# EAGLE schematic slave (EAGLE 9.5.0)
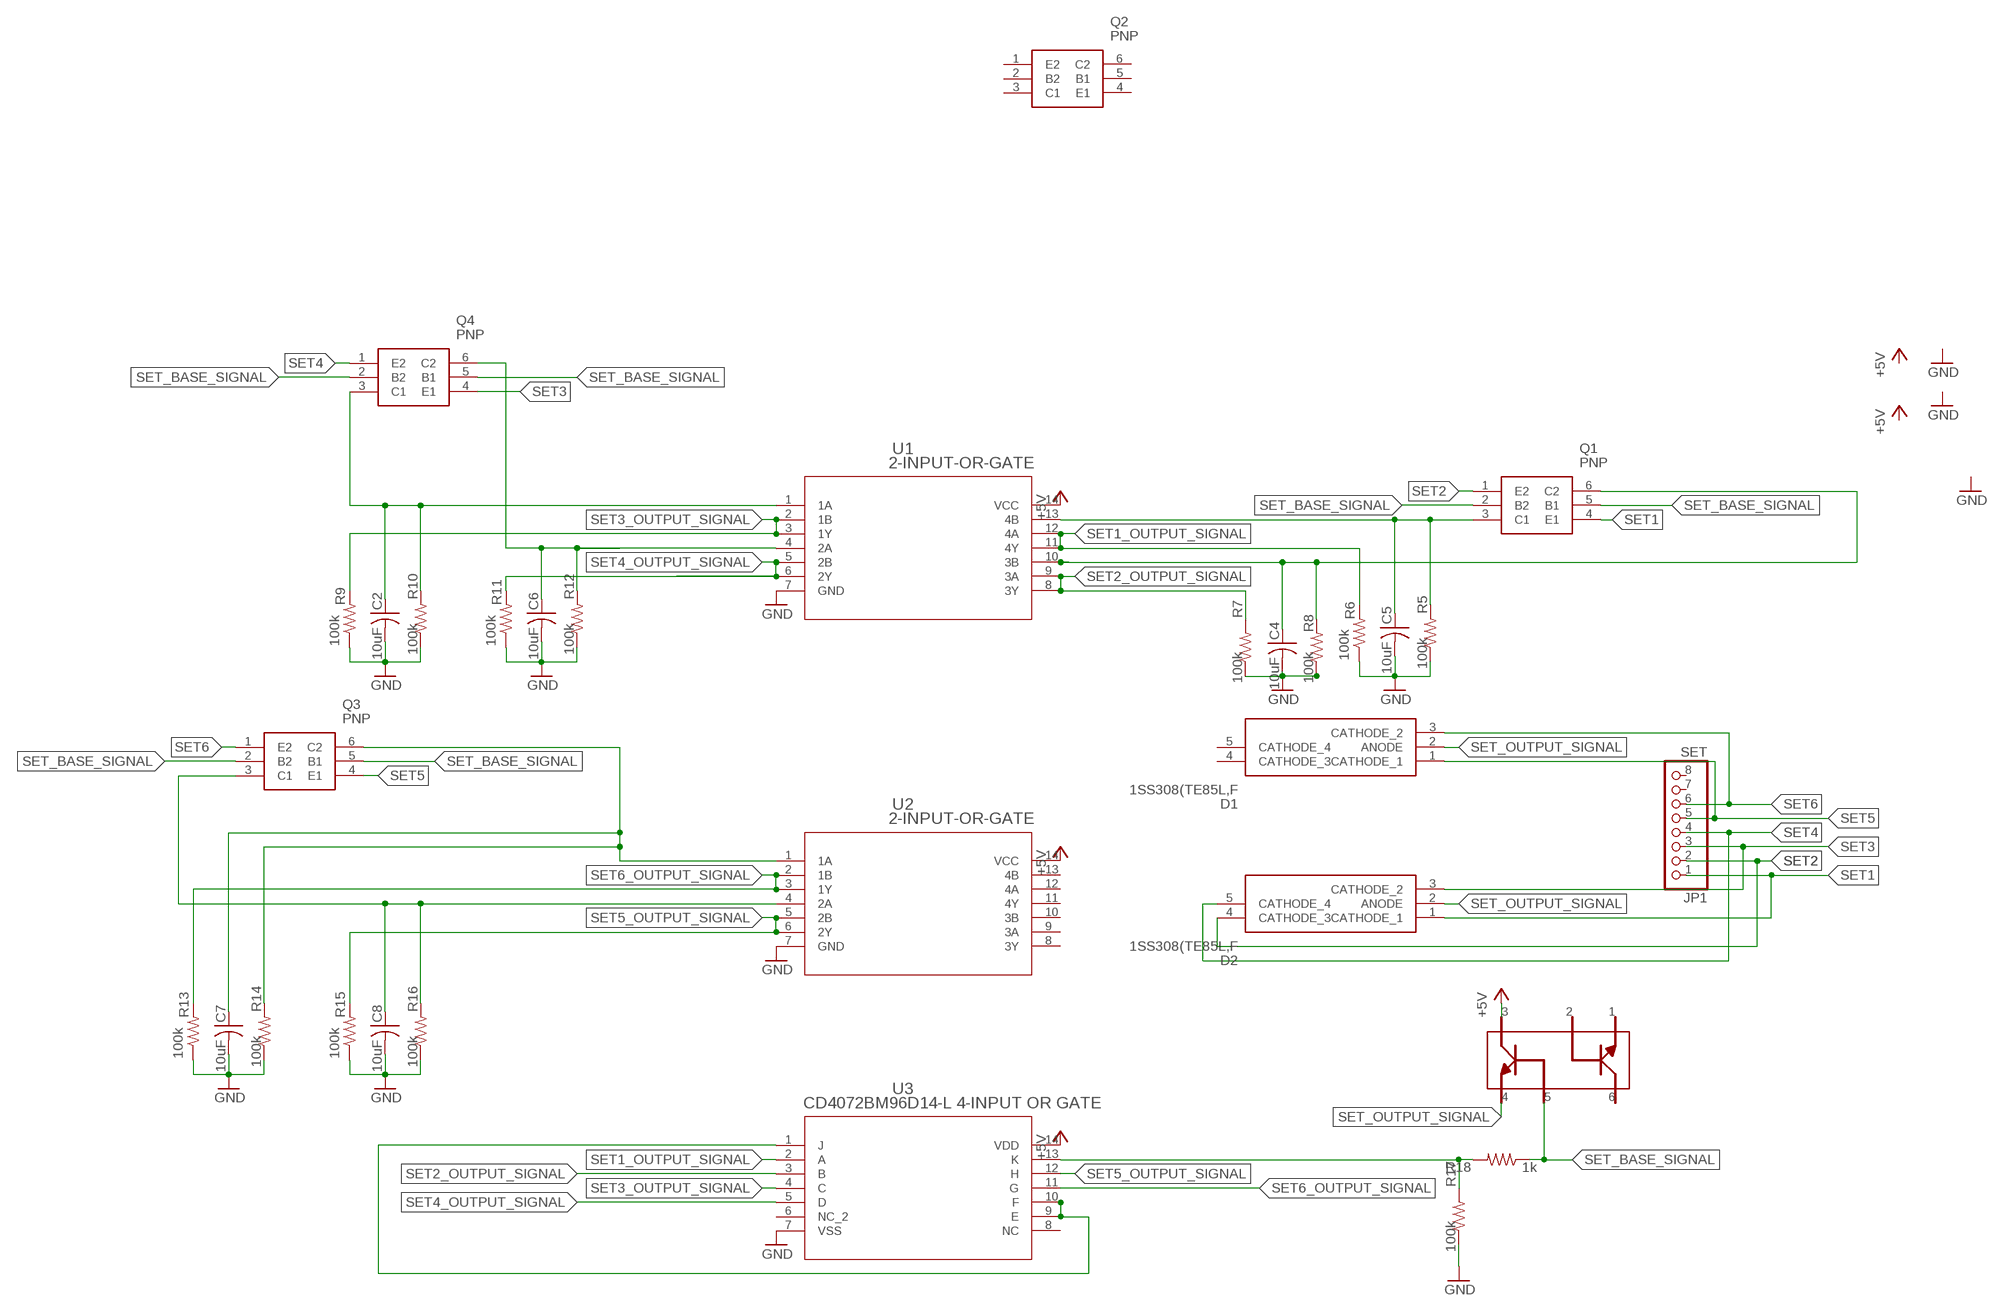
[diagram p0: schematic, sheet 1, part 1 of 2]
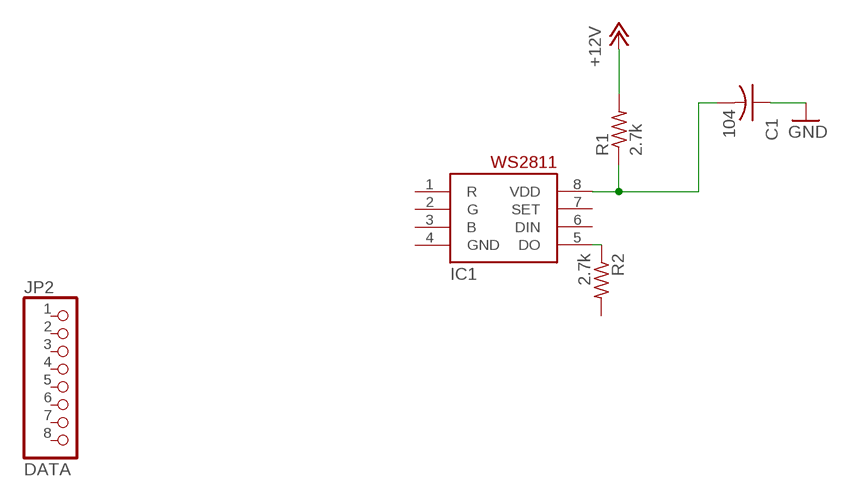
[diagram p1: schematic, sheet 1, part 2 of 2]

## Parts
C1  104  C-USC0805  [C0805]
C2  10uF  C-USC0805  [C0805]
C4  10uF  C-USC0805  [C0805]
C5  10uF  C-USC0805  [C0805]
C6  10uF  C-USC0805  [C0805]
C7  10uF  C-USC0805  [C0805]
C8  10uF  C-USC0805  [C0805]
D1  1SS308(TE85L,F  [SOT95P275X130-5N]
D2  1SS308(TE85L,F  [SOT95P275X130-5N]
IC1  WS2811-SOP8  [SO08-SKINNYPADS]
JP1  SET  PINHD-1X8-3.5MM  [1X08-3.5MM]
JP2  DATA  PINHD-1X8-3.5MM  [1X08-3.5MM]
Q1  PNP  MBT3906DW1T1G  [SOT65P210X110-6N]
Q2  PNP  MBT3906DW1T1G  [SOT65P210X110-6N]
Q3  PNP  MBT3906DW1T1G  [SOT65P210X110-6N]
Q4  PNP  MBT3906DW1T1G  [SOT65P210X110-6N]
R1  2.7k  R-US_M0805  [M0805]
R2  2.7k  R-US_M0805  [M0805]
R5  100k  R-US_M0805  [M0805]
R6  100k  R-US_M0805  [M0805]
R7  100k  R-US_M0805  [M0805]
R8  100k  R-US_M0805  [M0805]
R9  100k  R-US_M0805  [M0805]
R10  100k  R-US_M0805  [M0805]
R11  100k  R-US_M0805  [M0805]
R12  100k  R-US_M0805  [M0805]
R13  100k  R-US_M0805  [M0805]
R14  100k  R-US_M0805  [M0805]
R15  100k  R-US_M0805  [M0805]
R16  100k  R-US_M0805  [M0805]
R17  100k  R-US_M0805  [M0805]
R18  1k  R-US_M0805  [M0805]
U1  2-INPUT-OR-GATE  SN74AC32DRD14-L  [D14-L]
U2  2-INPUT-OR-GATE  SN74AC32DRD14-L  [D14-L]
U3  CD4072BM96D14-L 4-INPUT OR GATE  CD4072BM96D14-L  [D14-L]
U$1  MBT3904DW1T1G  [SOT236]

## Nets
+5V: U1.14(VCC) U2.14(VCC) U3.14(VDD) U$1.3
+12V: R1.2
GND: C1.1 C2.2 C4.2 C5.2 C6.2 C7.2 C8.2 R5.1 R6.1 R7.1 R8.1 R9.1 R10.1 R11.1 R12.1 R13.1 R14.1 R15.1 R16.1 R17.1 U1.7(GND) U2.7(GND) U3.7(VSS)
N$1: IC1.5(DO) R2.1
N$2: C1.2 IC1.8(VDD) R1.1
N$3: C6.1
N$4: C5.1 Q1.3(C1) R5.2 U1.13(4B)
N$10: U3.1(J) U3.9(E) U3.10(F)
N$12: Q4.6(C2) R12.2 U1.4(2A)
N$15: C4.1 Q1.6(C2) R8.2 U1.10(3B)
N$17: C2.1 Q4.3(C1) R10.2 U1.1(1A)
N$19: R17.2 R18.2 U3.13(K)
N$26: C7.1 Q3.6(C2) R14.2 U2.1(1A)
N$29: C8.1 Q3.3(C1) R16.2 U2.4(2A)
SET1: D2.1(CATHODE_1) JP1.1 Q1.4(E1)
SET1_OUTPUT_SIGNAL: R6.2 U1.11(4Y) U1.12(4A) U3.2(A)
SET2: D2.4(CATHODE_3) JP1.2 Q1.1(E2)
SET2_OUTPUT_SIGNAL: R7.2 U1.8(3Y) U1.9(3A) U3.3(B)
SET3: D2.3(CATHODE_2) JP1.3 Q4.4(E1)
SET3_OUTPUT_SIGNAL: R9.2 U1.2(1B) U1.3(1Y) U3.4(C)
SET4: D2.5(CATHODE_4) JP1.4 Q4.1(E2)
SET4_OUTPUT_SIGNAL: R11.2 U1.5(2B) U1.6(2Y) U3.5(D)
SET5: D1.1(CATHODE_1) JP1.5 Q3.4(E1)
SET5_OUTPUT_SIGNAL: R15.2 U2.5(2B) U2.6(2Y) U3.12(H)
SET6: D1.3(CATHODE_2) JP1.6 Q3.1(E2)
SET6_OUTPUT_SIGNAL: R13.2 U2.2(1B) U2.3(1Y) U3.11(G)
SET_BASE_SIGNAL: Q1.2(B2) Q1.5(B1) Q3.2(B2) Q3.5(B1) Q4.2(B2) Q4.5(B1) R18.1 U$1.5
SET_OUTPUT_SIGNAL: D1.2(ANODE) D2.2(ANODE) U$1.4
Unconnected: D1.4(CATHODE_3) D1.5(CATHODE_4) IC1.1(R) IC1.2(G) IC1.3(B) IC1.6(DIN) IC1.7(SET) JP1.7 JP1.8 JP2.1 JP2.2 JP2.3 JP2.4 JP2.5 JP2.6 JP2.7 JP2.8 Q2.1(E2) Q2.2(B2) Q2.3(C1) Q2.4(E1) Q2.5(B1) Q2.6(C2) R2.2 U2.8(3Y) U2.9(3A) U2.10(3B) U2.11(4Y) U2.12(4A) U2.13(4B) U3.6(NC_2) U3.8(NC) U$1.1 U$1.2 U$1.6

## Power pins joined to a net without a drawn wire
GND: IC1.4(GND)

## Library data of the parts
C1 C2 C4-C8 = adafruit:C-US: CAPACITOR, American symbol
D1 D2 = 1SS308(TE85L_F:1SS308(TE85L,F: Diodes - General Purpose, Power, Switching 0.1A 80V Switching High-Speed Diode Source: Datasheet <https://componentsearchengine.com/Datasheets/1/1SS308(TE85L,F.pdf>; DESCRIPTION: Diodes - General Purpose, Power, Switching 0.1A 80V Switching High-Speed Diode; HEIGHT: 1.3mm; MANUFACTURER_NAME: Toshiba; MANUFACTURER_PART_NUMBER: 1SS308(TE85L,F
IC1 = adafruit:WS2811
JP1 JP2 = adafruit:PINHD-1X8: PIN HEADER
Q1-Q4 = MBT3906DW1T1G:MBT3906DW1T1G: Source: Datasheet <http://www.onsemi.com/pub/Collateral/MBT3906DW1T1-D.PDF>; HEIGHT: 1.1mm; MANUFACTURER_NAME: ON Semiconductor; MANUFACTURER_PART_NUMBER: MBT3906DW1T1G; MOUSER_PART_NUMBER: 863-MBT3906DW1T1G; MOUSER_PRICE-STOCK: https://www.mouser.com/Search/Refine.aspx?Keyword=863-MBT3906DW1T1G; RS_PART_NUMBER: 7916075P; RS_PRICE-STOCK: http://uk.rs-online.com/web/p/products/7916075P
R1 R2 R5-R18 = adafruit:R-US_: RESISTOR, American symbol
U1 U2 = hexlight:SN74AC32DR: SN74AC32DR - 4CH 2-INPUT OR GATE; MANUFACTURER_PART_NUMBER: SN74AC32DR; VENDOR: Vendor
U3 = 4-IN-OR-GATE:CD4072BM96: CD4072BM96 - 4 INPUT OR GATE; MANUFACTURER_PART_NUMBER: CD4072BM96; VENDOR: Texas Instruments
U$1 = MBT3904DW1T1G:MBT3904DW1T1G; AVAILABILITY: Unavailable; DESCRIPTION: MBT Series 40 V 200 mA SMT NPN Silicon Dual General Purpose Transistor - SOT-363; MF: ON Semiconductor; MP: MBT3904DW1T1G; PACKAGE: SOT-363 ON Semiconductor; PRICE: None